# EasyEDA Pro project ProProject_circuller_2023-10-12.epro

# Schematic Schematic1
Create Date: 2023-10-07; Page Name: P1; Project Name: circuller; Schematic Name: Schematic1; Update Date: 2023-10-11; Company: MPAM Lab; Page Size: A3; Version: 0.1
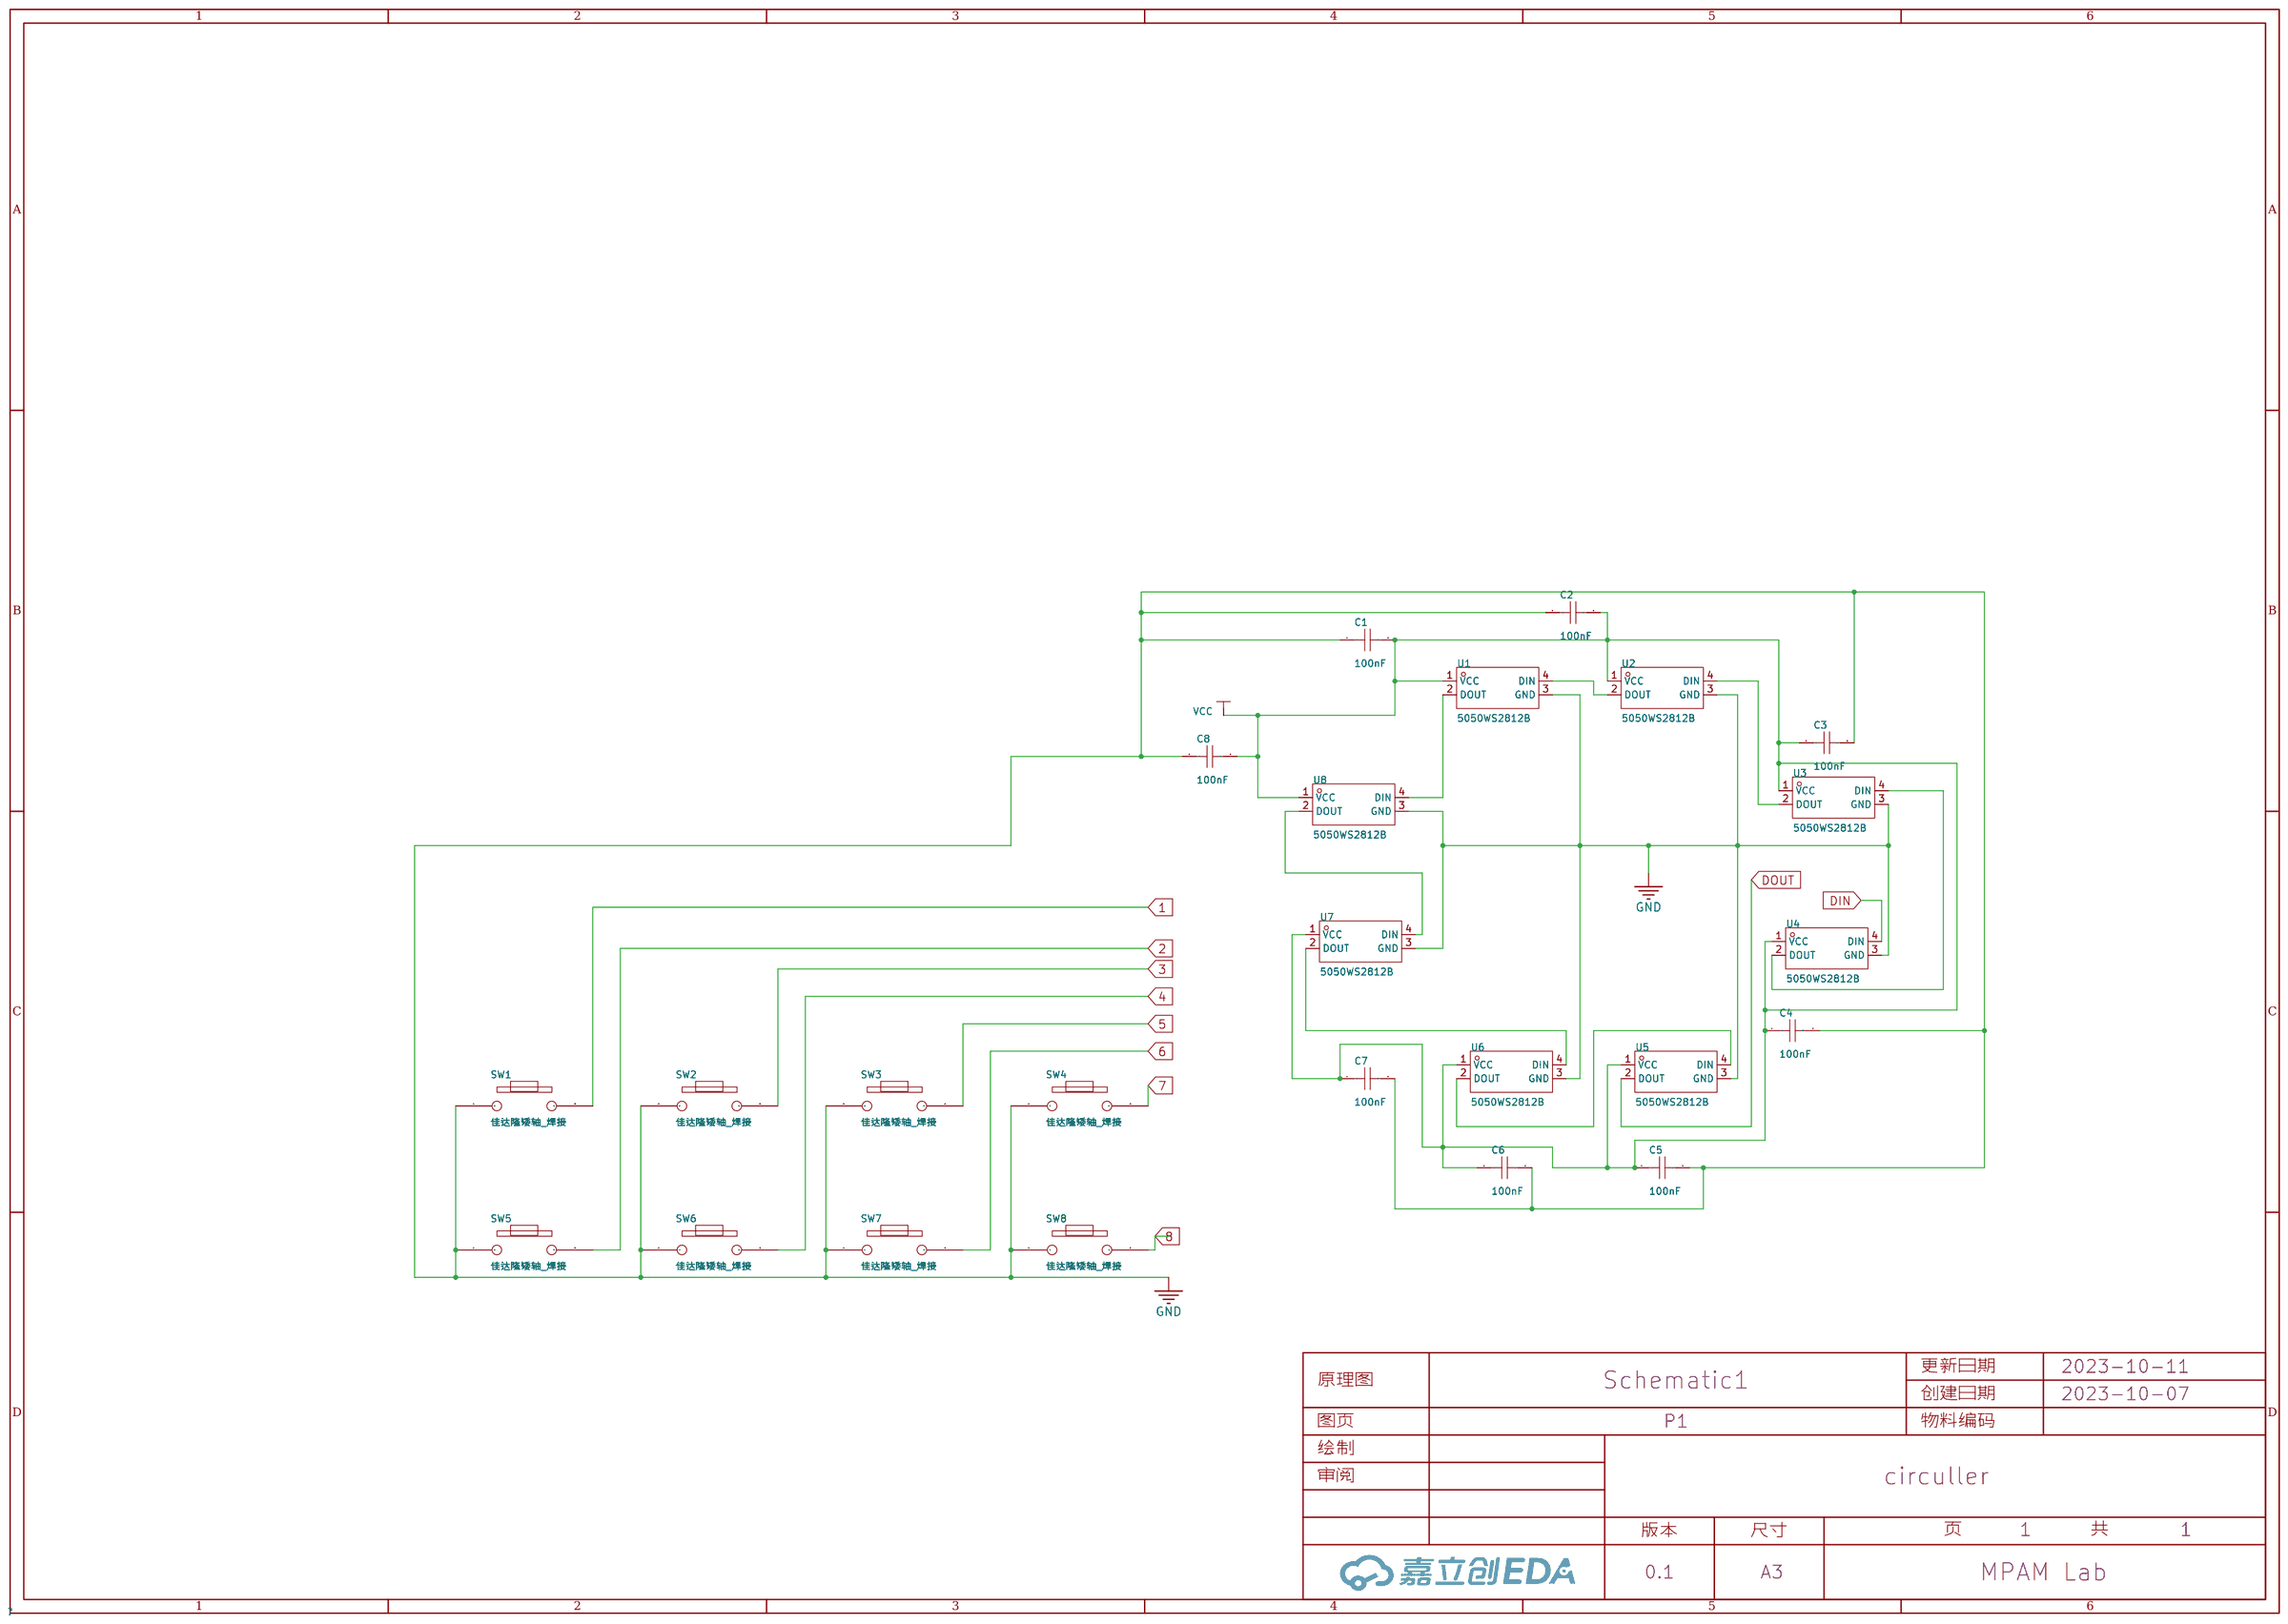
[diagram p0: schematic sheet]

## Parts
C1  100nF  [C0603]
C2  100nF  [C0603]
C3  100nF  [C0603]
C4  100nF  [C0603]
C5  100nF  [C0603]
C6  100nF  [C0603]
C7  100nF  [C0603]
C8  100nF  [C0603]
SW1  佳达隆矮轴_焊接  [佳达隆矮轴焊接]
SW2  佳达隆矮轴_焊接  [佳达隆矮轴焊接]
SW3  佳达隆矮轴_焊接  [佳达隆矮轴焊接]
SW4  佳达隆矮轴_焊接  [佳达隆矮轴焊接]
SW5  佳达隆矮轴_焊接  [佳达隆矮轴焊接]
SW6  佳达隆矮轴_焊接  [佳达隆矮轴焊接]
SW7  佳达隆矮轴_焊接  [佳达隆矮轴焊接]
SW8  佳达隆矮轴_焊接  [佳达隆矮轴焊接]
U1  5050WS2812B  [LED-SMD_5050WS2812B]
U2  5050WS2812B  [LED-SMD_5050WS2812B]
U3  5050WS2812B  [LED-SMD_5050WS2812B]
U4  5050WS2812B  [LED-SMD_5050WS2812B]
U5  5050WS2812B  [LED-SMD_5050WS2812B]
U6  5050WS2812B  [LED-SMD_5050WS2812B]
U7  5050WS2812B  [LED-SMD_5050WS2812B]
U8  5050WS2812B  [LED-SMD_5050WS2812B]

## Library data of the parts
C1-C8 = CAP_0603: Supplier Footprint: 0603
SW1-SW8 = 佳达隆矮轴_焊接: Supplier: eyy
U1-U8 = 5050WS2812B: Supplier Part: C2874876; Supplier Footprint: LED-SMD-4_L5.0-W5.0-P3.20-LS5.4; JLCPCB Part Class: 扩展库; Datasheet: 2021-08-01/763763S/fc73e402754744b5b9326c8825dec5cc/ws2812B.pdf; Supplier: LCSC

## Nets
GND: C1.1 C2.1 C3.2 C4.2 C5.2 C6.2 C7.2 C8.1 SW1.1 SW2.1 SW3.1 SW4.1 SW5.1 SW6.1 SW7.1 SW8.1 U1.3(GND) U2.3(GND) U3.3(GND) U4.3(GND) U5.3(GND) U6.3(GND) U7.3(GND) U8.3(GND)
VCC: C1.2 C2.2 C3.1 C4.1 C5.1 C6.1 C7.1 C8.2 U1.1(VCC) U2.1(VCC) U3.1(VCC) U4.1(VCC) U5.1(VCC) U6.1(VCC) U7.1(VCC) U8.1(VCC)
1: SW1.2
2: SW5.2
3: SW2.2
4: SW6.2
5: SW3.2
6: SW7.2
7: SW4.2
8: SW8.2
DIN: U4.4(DIN)
DOUT: U5.2(DOUT)
$1N1699: U1.2(DOUT) U8.4(DIN)
$1N1729: U1.4(DIN) U2.2(DOUT)
$1N1734: U2.4(DIN) U3.2(DOUT)
$1N1800: U3.4(DIN) U4.2(DOUT)
$1N1842: U6.4(DIN) U7.2(DOUT)
$1N1852: U5.4(DIN) U6.2(DOUT)
$1N6884: U7.4(DIN) U8.2(DOUT)

# Board PCB5
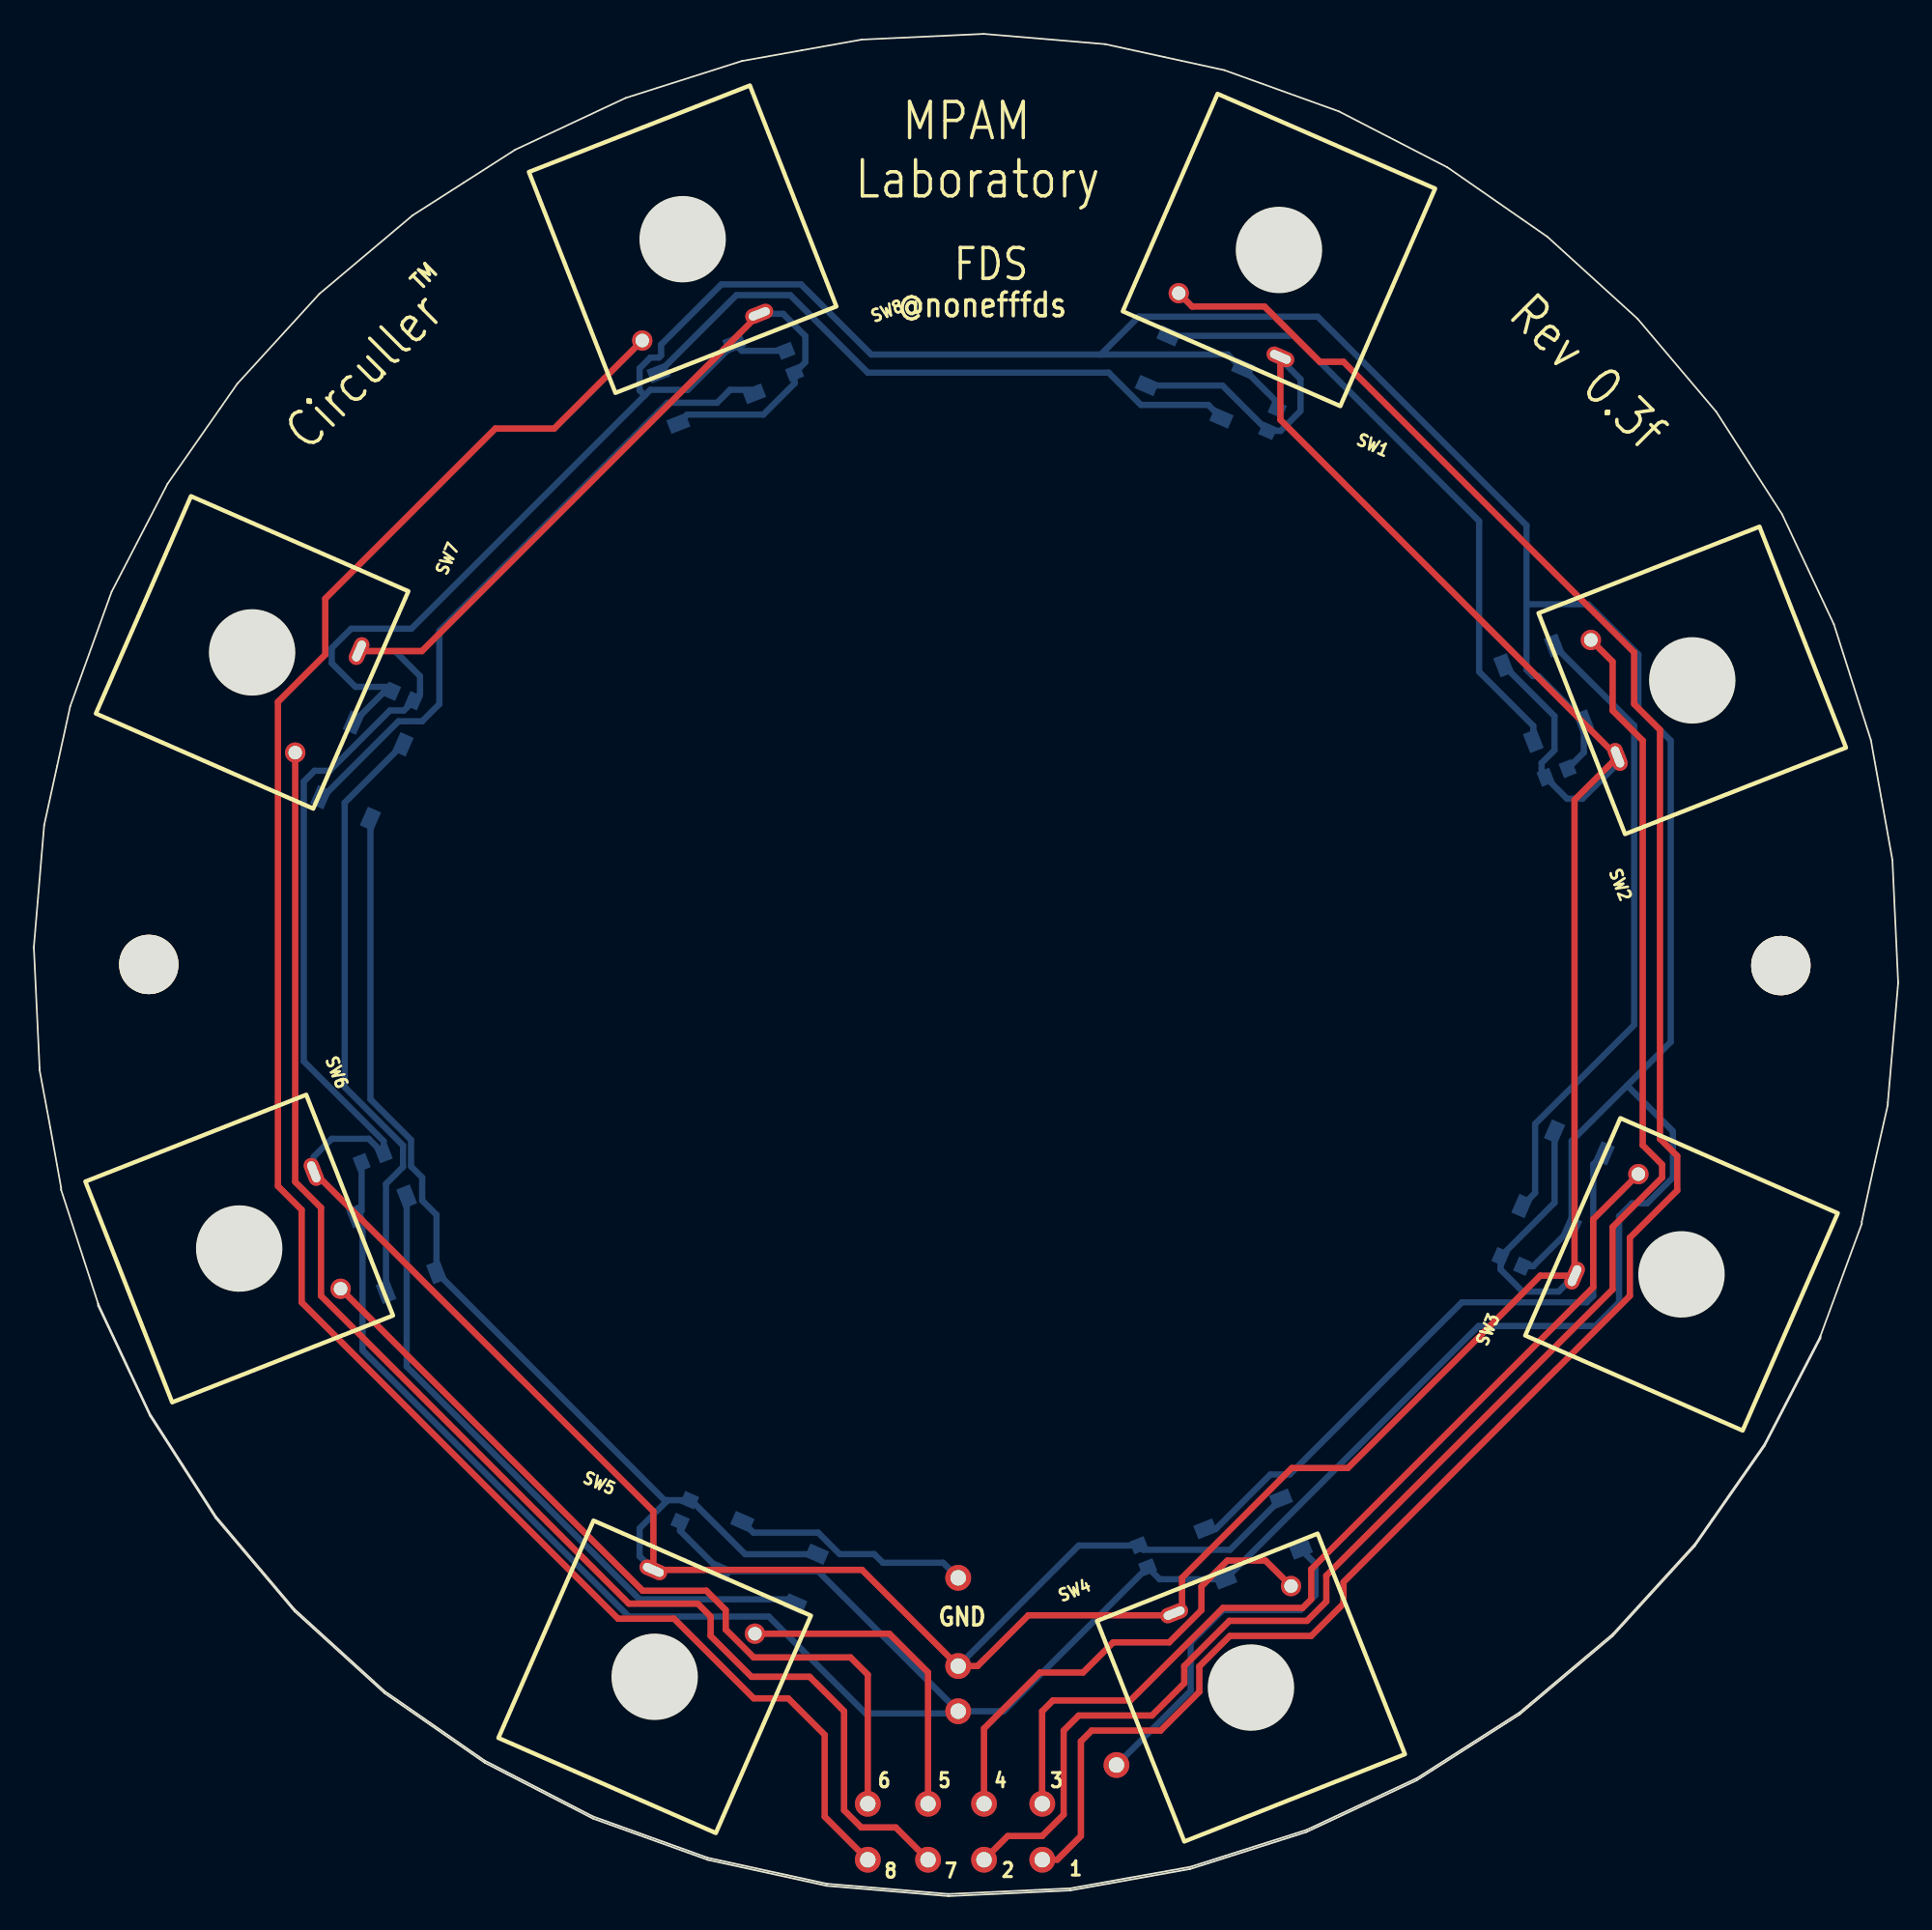
[diagram p1: board, top side]
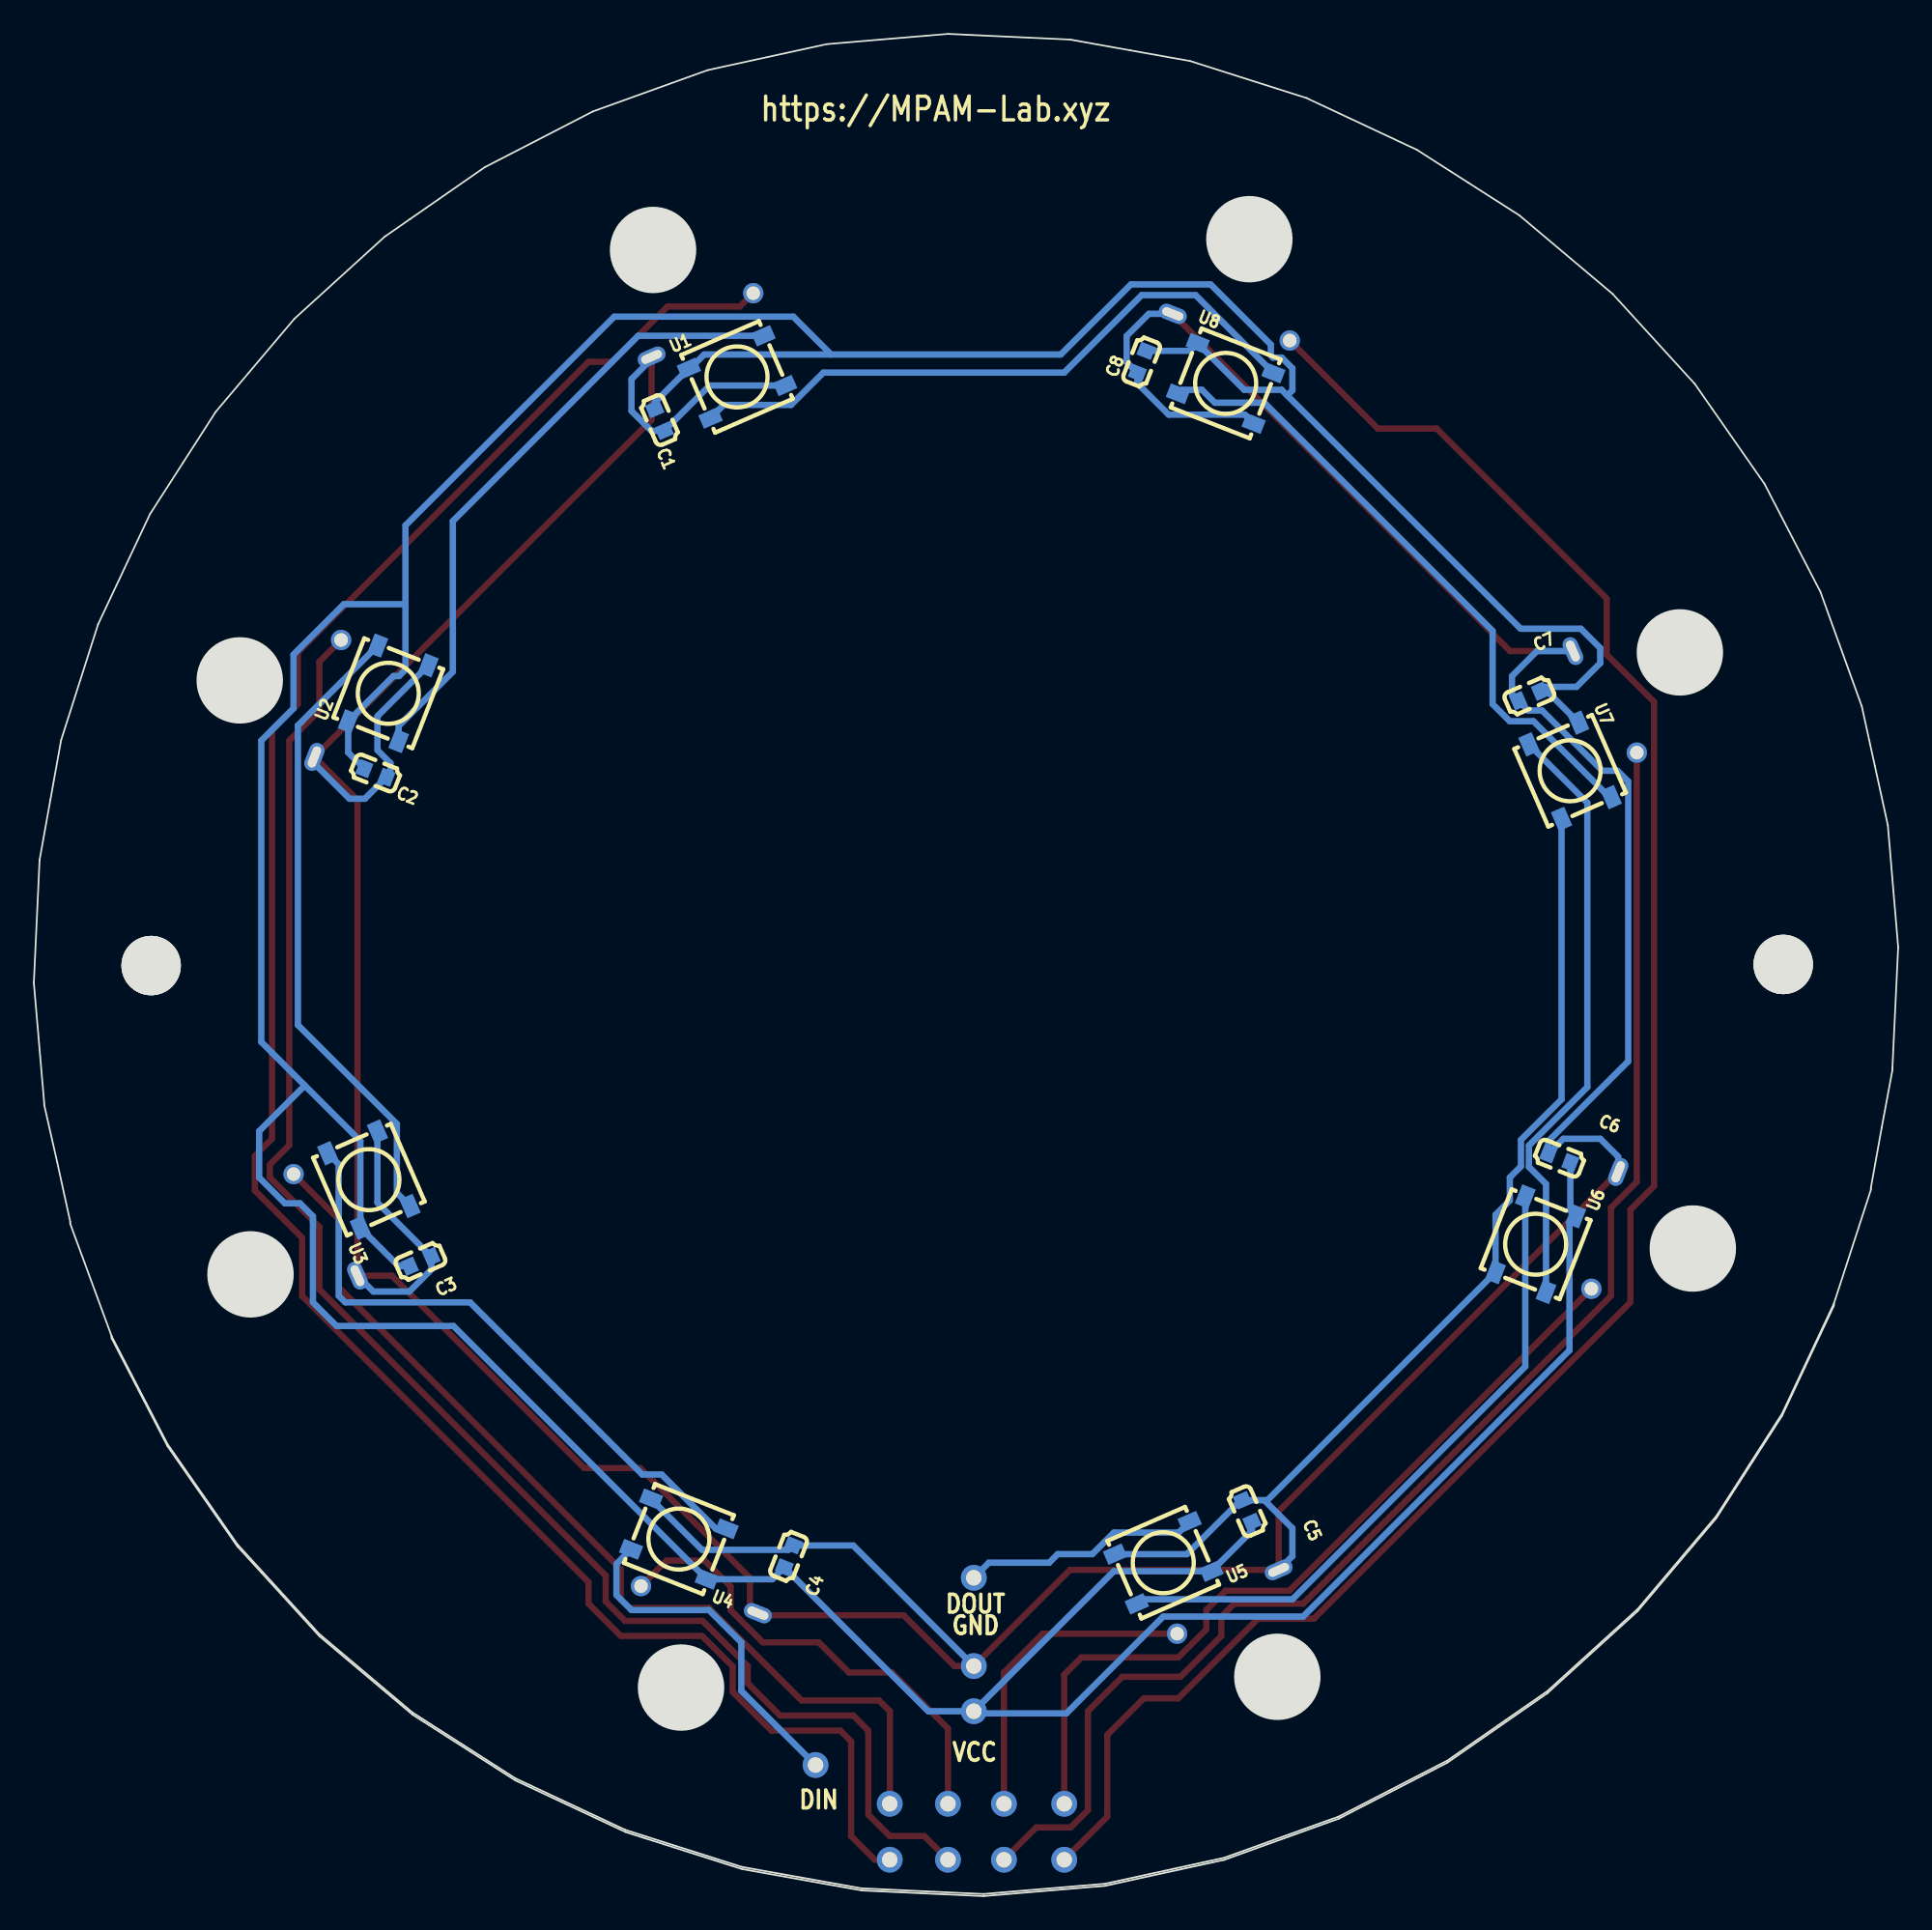
[diagram p2: board, bottom side, seen from below]

Outline 109.98 x 109.89 mm; copper layers: Top Layer, Bottom Layer. Coordinates in mm from the lower left corner of the outline.
Outline path: 3.79,34.96 1.6,41.68 1.6,41.81 0.97,45.34 0.33,48.75 0.33,48.87 0,55.92 0,56.05 0.61,63.2 1.37,66.71 2.14,70.22 4.58,76.97 7.89,83.35 12,89.24 16.84,94.55 22.34,99.18 25.37,101.12 28.39,103.06 34.91,106.11 41.76,108.29 45.3,108.93 48.84,109.56 56.03,109.89 63.2,109.29 66.71,108.52 70.23,107.75 76.99,105.32 83.38,102.02 89.29,97.92 94.61,93.08 99.25,87.6 101.19,84.58 103.13,81.55 106.19,75.05 108.38,68.21 109.01,64.68 109.65,61.14 109.98,53.97 109.98,53.85 109.37,46.82 109.37,46.69 108.61,43.31 107.84,39.8 107.84,39.68 105.4,33.05 ; 3.79,34.96 3.79,34.84 6.85,28.34 10.73,22.3 15.37,16.81 20.69,11.97 26.6,7.87 32.99,4.57 39.75,2.14 46.78,0.61 53.95,0 61.14,0.33 68.22,1.6 75.07,3.78 81.59,6.84 87.64,10.71 93.14,15.34 97.98,20.65 102.09,26.54 105.4,32.92 105.4,33.05 ; 3.79,34.96 6.85,28.46 8.79,25.44 10.73,22.42 15.37,16.93 20.69,12.1 23.64,10.05 26.6,8 32.99,4.7 39.75,2.26 43.27,1.5 46.78,0.73 53.95,0.12 61.14,0.46 64.68,1.09 68.22,1.73 75.07,3.91 81.59,6.96 84.61,8.9 87.64,10.83 93.14,15.47 97.98,20.77 102.09,26.67 105.4,33.05
Stack: Top Layer 0.035mm / Dielectric1 1.51mm FR4 er 4.5 / Bottom Layer 0.035mm

## Design rules (mm)
template: JLCPCB Capability(Two Layers Board)
spacing copperThickness1oz (default): track to track 0.102, other pairs 0.152 to 0.3
spacing copperThickness2oz: track to track 0.203, other pairs 0.152 to 0.3
track width copperThickness1oz (default): min 0.127, default 0.254, max 2.54
track width copperThickness2oz: min 0.203, default 0.254, max 2.54
differential pair differentialPair (default): width min 0.127, default 0.254, max 2.54; gap min 0.152, default 0.152
via viaSize (default): diameter min 0.5, default 0.61, max 10; hole min 0.3, default 0.305, max 6.3

## Placement (name value [footprint] x y rotation side)
C1  100nF  [C0603]  73.07 87.11 66.5 bottom
C2  100nF  [C0603]  89.84 66.28 21.4 bottom
C3  100nF  [C0603]  87.17 37.45 156.4 bottom
C4  100nF  [C0603]  65.45 20.05 111.6 bottom
C5  100nF  [C0603]  38.4 22.72 66.4 bottom
C6  100nF  [C0603]  19.99 43.55 21.5 bottom
C7  100nF  [C0603]  21.76 70.82 336.4 bottom
C8  100nF  [C0603]  44.62 90.54 111.4 bottom
NOREF  -  [Pad_e1160]  54.53 18.78 0 top
NOREF#2  -  [Pad_e820]  103.06 54.91 0 top
NOREF#3  -  [Pad_e819]  6.78 54.98 0 top
NOREF#4  -  [Pad_e284]  54.53 13.58 0 top
NOREF#5  -  [Pad_e278]  56.05 2.15 0 top
NOREF#6  -  [Pad_e276]  49.2 2.15 0 top
NOREF#7  -  [Pad_e279]  59.49 2.15 0 top
NOREF#8  -  [Pad_e1166]  63.87 7.74 0 top
NOREF#9  -  [Pad_e283]  59.49 5.45 0 top
NOREF#10  -  [Pad_e277]  52.75 2.15 0 top
NOREF#11  -  [Pad_e280]  49.2 5.45 0 top
NOREF#12  -  [Pad_e282]  56.05 5.45 0 top
NOREF#13  -  [Pad_e1124]  54.53 10.91 0 top
NOREF#14  -  [Pad_e281]  52.75 5.45 0 top
SW1  佳达隆矮轴_焊接  [佳达隆矮轴焊接]  73.45 97.14 156.5 top
SW2  佳达隆矮轴_焊接  [佳达隆矮轴焊接]  97.84 71.74 111.4 top
SW3  佳达隆矮轴_焊接  [佳达隆矮轴焊接]  97.2 36.69 66.4 top
SW4  佳达隆矮轴_焊接  [佳达隆矮轴焊接]  71.8 12.31 21.6 top
SW5  佳达隆矮轴_焊接  [佳达隆矮轴焊接]  36.62 12.94 336.4 top
SW6  佳达隆矮轴_焊接  [佳达隆矮轴焊接]  12.11 38.22 291.5 top
SW7  佳达隆矮轴_焊接  [佳达隆矮轴焊接]  12.87 73.39 246.4 top
SW8  佳达隆矮轴_焊接  [佳达隆矮轴焊接]  38.27 97.78 201.4 top
U1  5050WS2812B  [LED-SMD_5050WS2812B]  68.5 89.65 156.5 bottom
U2  5050WS2812B  [LED-SMD_5050WS2812B]  89.07 70.98 111.4 bottom
U3  5050WS2812B  [LED-SMD_5050WS2812B]  90.22 42.28 66.4 bottom
U4  5050WS2812B  [LED-SMD_5050WS2812B]  71.93 21.07 21.6 bottom
U5  5050WS2812B  [LED-SMD_5050WS2812B]  43.35 19.67 336.4 bottom
U6  5050WS2812B  [LED-SMD_5050WS2812B]  21.38 38.47 291.5 bottom
U7  5050WS2812B  [LED-SMD_5050WS2812B]  19.35 66.41 246.4 bottom
U8  5050WS2812B  [LED-SMD_5050WS2812B]  39.67 89.27 201.4 bottom

## Footprints (pads in the part's own frame, mm; a bottom-side part is the same pattern mirrored in y, then rotated)
C0603
  rect 0.8x0.9 smd: 1(-0.7,0) 2(0.7,0)
LED-SMD_5050WS2812B
  rect 1.2x0.85 smd: 1(-2.4,1.6) 2(-2.4,-1.6) 3(2.4,-1.6) 4(2.4,1.6)
Pad_e276
  round 1.524 hole 0.914: 1(0,0)
Pad_e277
  round 1.524 hole 0.914: 2(0,0)
Pad_e278
  round 1.524 hole 0.914: 3(0,0)
Pad_e279
  round 1.524 hole 0.914: 4(0,0)
Pad_e280
  round 1.524 hole 0.914: 5(0,0)
Pad_e281
  round 1.524 hole 0.914: 6(0,0)
Pad_e282
  round 1.524 hole 0.914: 7(0,0)
Pad_e283
  round 1.524 hole 0.914: 8(0,0)
Pad_e284
  round 1.524 hole 0.914: 9(0,0)
Pad_e819
  round 3.5 hole 3.5: 13(0,0)
Pad_e820
  round 3.5 hole 3.5: 14(0,0)
Pad_e1124
  round 1.524 hole 0.914: 10(0,0)
Pad_e1160
  round 1.524 hole 0.914: 11(0,0)
Pad_e1166
  round 1.524 hole 0.914: 12(0,0)
佳达隆矮轴焊接
  oval 1.7x0.9 hole 1.3x0.5: 1(-2.6,5.75)
  round 1.2 hole 0.8: 2(4.4,4.7)

## Nets
GND: C1.1 C2.1 C3.2 C4.2 C5.2 C6.2 C7.2 C8.1 NOREF#4.9 SW1.1 SW2.1 SW3.1 SW4.1 SW5.1 SW6.1 SW7.1 SW8.1 U1.3 U2.3 U3.3 U4.3 U5.3 U6.3 U7.3 U8.3
VCC: C1.2 C2.2 C3.1 C4.1 C5.1 C6.1 C7.1 C8.2 NOREF#13.10 U1.1 U2.1 U3.1 U4.1 U5.1 U6.1 U7.1 U8.1
1: NOREF#7.4 SW1.2
2: NOREF#14.6 SW5.2
3: NOREF#5.3 SW2.2
4: NOREF#11.5 SW6.2
5: NOREF#9.8 SW3.2
6: NOREF#10.2 SW7.2
7: NOREF#12.7 SW4.2
8: NOREF#6.1 SW8.2
DIN: NOREF#8.12 U4.4
DOUT: NOREF.11 U5.2
$1N1699: U1.2 U8.4
$1N1729: U1.4 U2.2
$1N1734: U2.4 U3.2
$1N1800: U3.4 U4.2
$1N1842: U6.4 U7.2
$1N1852: U5.4 U6.2
$1N6884: U7.4 U8.2

Pads without a net: NOREF#2 14; NOREF#3 13

## Via types
v1: diameter 0.61, hole 0.305, Top Layer to Bottom Layer, 1 via

## Routing (per net, layer and track width the routed paths; a pad name or vN(x,y) marks a point on that pad's centre or on a via; arc(x,y) is an arc through that point)
GND: length 382.3
  Top Layer w0.37: 73.37,90.67 73.54,90.83 73.54,87.12 SW2.1 90.89,64.69 SW3.1 88.87,36.61 77.52,25.26 74.21,25.26 67.74,18.78 67.74,17.16 SW4.1 67.14,16.57 58.67,16.57 55.67,13.58 v1(54.53,13.58) 48.85,19.25 36.54,19.25 36.54,22.71 SW6.1 ; SW7.1 22.89,73.47 SW8.1
  Bottom Layer w0.37: U1.3 70.12,89.14 C1.1 73.55,86.47 74.72,87.64 74.72,89.52 73.54,90.71 73.54,90.83 ; 36.54,19.25 35.73,20.06 35.73,21.71 37.39,23.36 ; 37.39,23.36 37.21,23.36 U6.3 23.75,40.21 22.91,41.05 22.91,42.41 22.25,43.06 22.25,44.63 19.85,47.02 19.85,63.57 ; 37.39,23.36 C5.2 38.78,23.36 41.96,20.18 46.19,20.18 ; 89.71,45.12 89.71,40.92 C3.2 86.53,36.98 87.83,35.68 89.95,35.68 SW3.1 ; 44.88,89.89 44.88,89.27 43.03,87.43 38.54,87.43 U8.3 ; 44.88,89.89 45.51,90.52 45.51,92.06 44.2,93.37 SW8.1 ; U4.3 70.57,20.44 65.46,20.44 C4.2 65.18,20.69 61.64,20.69 v1(54.53,13.58) ; SW6.1 16.51,43.63 17.57,44.69 19.75,44.69 20.64,43.81 20.64,44.55 15.92,49.26 15.92,65.77 16.56,66.41 17.45,66.41 21,69.97 21.83,69.97 C7.2 22.78,70.92 22.78,72 21.3,73.47 SW7.1 ; SW2.1 93.43,66.83 91.36,64.76 90.45,64.76 88.95,66.26 88.95,66.86 89.71,67.62 89.71,69.63 U2.3
VCC: length 325.9
  Bottom Layer w0.37: NOREF#13.10 57.22,10.91 C4.1 66.41,18.7 U4.1 85.23,33.64 92.12,33.64 93.52,35.04 93.52,40.12 94.28,40.88 95.17,40.88 96.69,42.41 96.69,45.14 94,47.84 ; NOREF#13.10 54.4,10.78 49.07,10.78 43.35,16.5 35.1,16.5 19.39,32.21 19.39,39.65 19.02,40.02 U6.1 19.33,40.44 C6.1 ; NOREF#13.10 46.27,19.17 U5.1 38.12,21.56 C5.1 ; 88.06,76.24 88.06,80.89 75.74,93.21 65.18,93.21 62.94,90.97 ; 88.06,76.24 88.06,72.38 88.44,72 88.77,72 U2.1 91.44,67.49 90.49,66.54 ; 88.06,76.24 91.69,76.24 94.66,73.27 94.66,70.09 96.57,68.19 96.57,50.41 94,47.84 ; 18.85,69.25 20.7,71.1 C7.1 20.86,71.36 18.97,71.36 17.57,72.76 17.57,73.65 18.72,74.79 22.27,74.79 36.04,88.56 ; 62.94,90.97 70.43,90.97 71.25,90.16 U1.1 73.35,88.15 C1.2 ; 62.94,90.97 49.4,90.97 45.26,95.11 40.56,95.11 37,91.56 37,90.92 36.88,90.79 36.37,90.79 35.73,90.16 35.73,88.86 36.04,88.56 ; 94,47.84 90.72,44.56 90.72,39.44 88.45,37.17 C3.1 ; 44.37,91.19 41.76,91.19 U8.1 38.58,88.89 36.37,88.89 36.04,88.56
1: length 129.2
  Top Layer w0.37: NOREF#7.4 60.37,2.15 61.77,3.54 61.77,9.13 62.4,9.77 66.47,9.77 68.75,12.05 68.75,13.55 70.56,15.36 75.36,15.36 77.26,17.26 77.26,18.53 94.15,35.42 94.15,38.85 96.95,41.64 96.95,43.68 95.93,44.69 95.93,68.82 94.41,70.35 94.41,73.39 77.26,90.54 75.87,90.54 72.6,93.81 68.33,93.81 SW1.2
2: length 18.9
  Top Layer w0.37: 42.54,15.49 50.46,15.49 52.75,13.2 NOREF#14.6
3: length 96.7
  Top Layer w0.37: NOREF#5.3 57.45,3.54 59.48,3.54 60.75,4.81 60.75,9.77 61.64,10.66 65.96,10.66 67.86,12.56 67.86,13.58 70.53,16.24 75.1,16.24 76.25,17.39 76.25,18.91 93.14,35.8 93.14,39.49 96.06,42.41 96.06,43.17 94.92,44.31 94.92,68.19 93.14,69.97 93.14,72.85 91.86,74.13
4: length 48.8
  Top Layer w0.37: SW6.2 35.91,18.02 39.67,18.02 40.81,16.88 40.81,15.74 42.46,14.09 48.18,14.09 49.2,13.07 NOREF#11.5
5: length 57.2
  Top Layer w0.37: SW3.2 91.99,39.94 91.99,35.93 75.36,19.29 75.36,17.51 74.85,17.01 70.15,17.01 64.69,11.55 60.12,11.55 59.48,10.91 59.48,5.46 NOREF#9.8
6: length 86.4
  Top Layer w0.37: NOREF#10.2 50.85,4.05 48.81,4.05 47.8,5.07 47.8,10.91 45.77,12.94 42.34,12.94 39.92,15.36 39.92,16.5 39.16,17.26 35.1,17.26 16.94,35.42 16.94,40.63 15.42,42.15 SW7.2
7: length 28.1
  Top Layer w0.37: SW4.2 72.66,19.8 70.4,19.8 68.88,18.28 68.88,16.88 66.98,14.97 63.67,14.97 61.9,13.2 59.36,13.2 56.05,9.89 NOREF#12.7
8: length 118.1
  Top Layer w0.37: NOREF#6.1 46.66,4.69 46.66,9.51 44.5,11.67 42.46,11.67 37.77,16.37 34.46,16.37 15.79,35.04 15.79,40.5 14.4,41.9 14.4,70.47 17.19,73.27 17.19,76.57 27.22,86.6 30.69,86.6 SW8.2
DIN: length 20.6
  Bottom Layer w0.37: U4.4 75.61,19.6 75.61,17.77 74.72,16.88 70.15,16.88 68.25,14.97 68.25,12.11 NOREF#8.12
DOUT: length 14.1
  Bottom Layer w0.37: U5.2 42.45,21.45 46.27,21.45 47.54,20.18 49.58,20.18 50.08,19.67 53.64,19.67 NOREF.11
$1N1699: length 38.1
  Bottom Layer w0.37: U1.2 69.29,88 65.31,88 63.4,89.9 49.2,89.9 44.62,94.48 41.44,94.48 36.85,89.88
$1N1729: length 37.2
  Bottom Layer w0.37: 88.46,68.16 88.46,69.06 85.26,72.25 85.26,81.14 74.33,92.08 U1.4
$1N1734: length 37.8
  Bottom Layer w0.37: 89.69,73.8 94.41,69.08 94.41,51.41 88.57,45.57 88.57,41.5 87.79,40.72
$1N1800: length 37.3
  Bottom Layer w0.37: U4.2 69.74,21.67 72.94,24.88 74.09,24.88 84.25,35.04 91.61,35.04 91.99,35.42 91.99,43.19 U3.4
$1N1842: length 35.6
  Bottom Layer w0.37: U6.4 20.77,42.03 21.78,43.03 21.78,44.3 18.33,47.74 18.33,64.52 21.78,67.97
$1N1852: length 38.8
  Bottom Layer w0.37: U5.4 44.64,17.51 35.73,17.51 21.99,31.25 U6.2
$1N6884: length 38.1
  Bottom Layer w0.37: U7.4 17.03,64.85 21.51,69.33 22.91,69.33 23.92,70.35 23.92,74.66 37.38,88.13 40.31,88.13 41.07,88.89 42.25,88.89 U8.2

## Text on the board
Bottom Silkscreen Layer: VCC | GND | DOUT | DIN | https://MPAM-Lab.xyz
Top Silkscreen Layer: 6 | 8 | 5 | 7 | 4 | 2 | 3 | 1 | TM | GND | @nonefffds | FDS | Circuller | Rev 0.3f | MPAM / Laboratory
